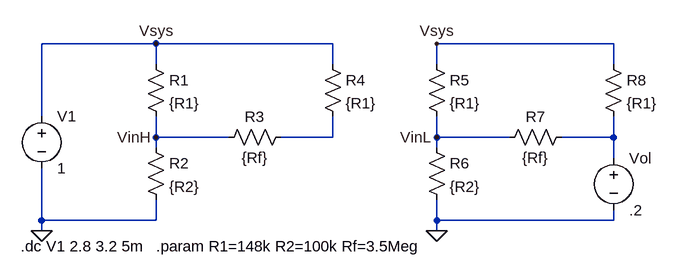
[diagram p0: schematic ComparatorEquivalent.asc]
ComparatorEquivalent.asc, the LTspice schematic file:
Version 4.1
SHEET 1 892 680
WIRE -16 16 -192 16
WIRE 256 16 -16 16
WIRE 688 16 416 16
WIRE -16 48 -16 16
WIRE 256 48 256 16
WIRE 416 48 416 16
WIRE 688 48 688 16
WIRE -192 128 -192 16
WIRE -16 160 -16 128
WIRE 96 160 -16 160
WIRE 256 160 256 128
WIRE 256 160 176 160
WIRE 416 160 416 128
WIRE 528 160 416 160
WIRE 688 160 688 128
WIRE 688 160 608 160
WIRE -16 176 -16 160
WIRE 416 176 416 160
WIRE 688 192 688 160
WIRE -192 288 -192 208
WIRE -16 288 -16 256
WIRE -16 288 -192 288
WIRE 416 288 416 256
WIRE 688 288 688 272
WIRE 688 288 416 288
WIRE -192 304 -192 288
WIRE 416 304 416 288
FLAG -192 304 0
FLAG 416 304 0
FLAG -16 16 Vsys
FLAG 416 16 Vsys
FLAG -16 160 VinH
FLAG 416 160 VinL
SYMBOL voltage -192 112 R0
SYMATTR InstName V1
SYMATTR Value 1
SYMBOL res -32 32 R0
SYMATTR InstName R1
SYMATTR Value {R1}
SYMBOL res -32 160 R0
SYMATTR InstName R2
SYMATTR Value {R2}
SYMBOL res 192 144 R90
WINDOW 0 0 56 VBottom 2
WINDOW 3 32 56 VTop 2
SYMATTR InstName R3
SYMATTR Value {Rf}
SYMBOL res 240 32 R0
SYMATTR InstName R4
SYMATTR Value {R1}
SYMBOL res 400 32 R0
SYMATTR InstName R5
SYMATTR Value {R1}
SYMBOL res 400 160 R0
SYMATTR InstName R6
SYMATTR Value {R2}
SYMBOL res 624 144 R90
WINDOW 0 0 56 VBottom 2
WINDOW 3 32 56 VTop 2
SYMATTR InstName R7
SYMATTR Value {Rf}
SYMBOL res 672 32 R0
SYMATTR InstName R8
SYMATTR Value {R1}
SYMBOL voltage 688 176 R0
WINDOW 123 0 0 Left 0
WINDOW 39 0 0 Left 0
SYMATTR InstName Vol
SYMATTR Value .2
TEXT -16 328 Left 2 !.param R1=148k R2=100k Rf=3.5Meg
TEXT -224 328 Left 2 !.dc V1 2.8 3.2 5m

The netlist it stands for:
* ComparatorEquivalent.asc
V1 Vsys 0 1
R1 Vsys VinH {R1}
R2 VinH 0 {R2}
R3 N001 VinH {Rf}
R4 Vsys N001 {R1}
R5 Vsys VinL {R1}
R6 VinL 0 {R2}
R7 N002 VinL {Rf}
R8 Vsys N002 {R1}
Vol N002 0 .2
.param R1=148k R2=100k Rf=3.5Meg
.dc V1 2.8 3.2 5m
.backanno
.end